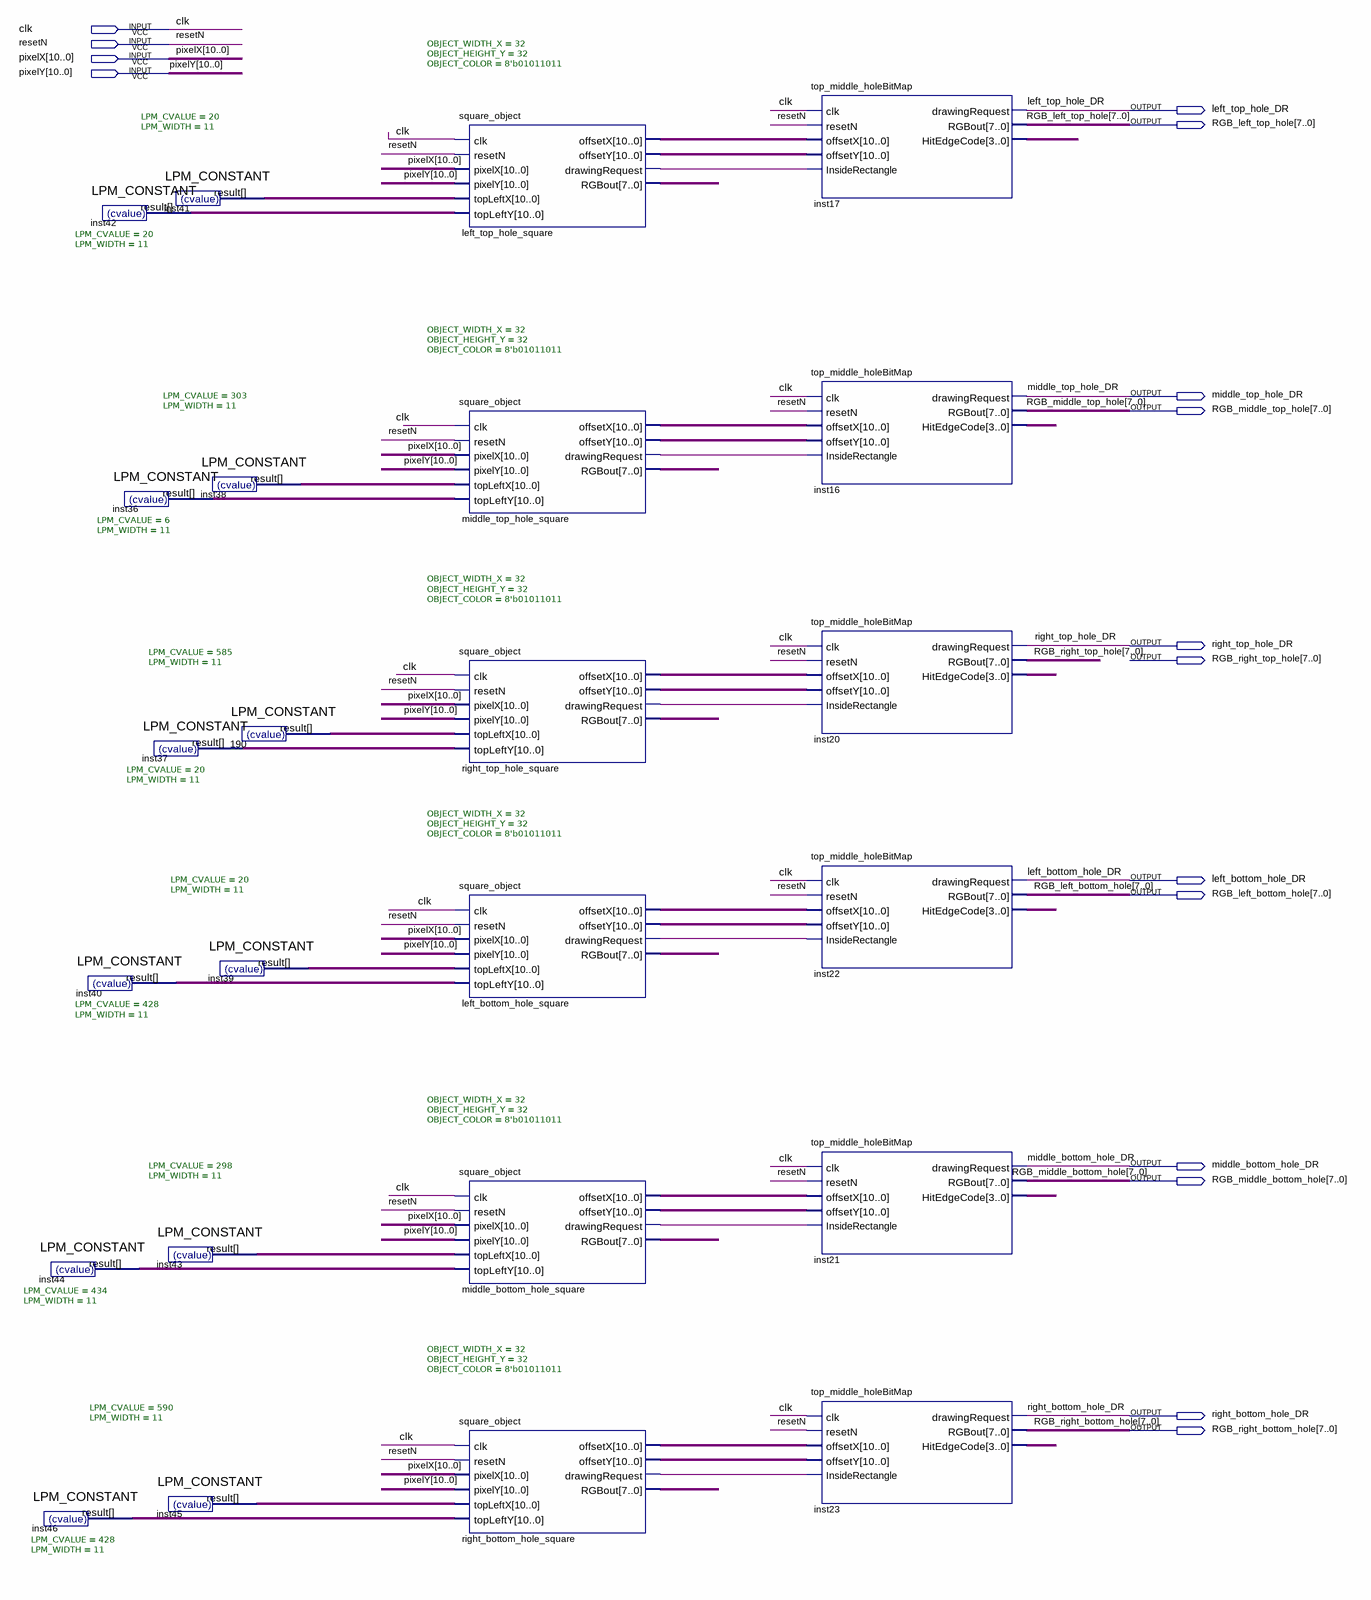
[diagram p0: schematic sheet]
// Quartus schematic Holes_block.bdf as structural Verilog: 24 symbols, 16 pins
module Holes_block (
  input  clk,
  input  resetN,
  input  [10:0] pixelX,
  input  [10:0] pixelY,
  output left_top_hole_DR,
  output [7:0] RGB_left_top_hole,
  output middle_top_hole_DR,
  output [7:0] RGB_middle_top_hole,
  output right_top_hole_DR,
  output [7:0] RGB_right_top_hole,
  output left_bottom_hole_DR,
  output [7:0] RGB_left_bottom_hole,
  output middle_bottom_hole_DR,
  output [7:0] RGB_middle_bottom_hole,
  output right_bottom_hole_DR,
  output [7:0] RGB_right_bottom_hole
);

  wire left_bottom_hole_square_drawingrequest, left_top_hole_square_drawingrequest,
       middle_bottom_hole_square_drawingrequest, middle_top_hole_square_drawingrequest,
       right_bottom_hole_square_drawingrequest, right_top_hole_square_drawingrequest;
  wire [3:0] inst16_hitedgecode, inst17_hitedgecode, inst20_hitedgecode, inst21_hitedgecode,
       inst22_hitedgecode, inst23_hitedgecode;
  wire [7:0] left_bottom_hole_square_rgbout, left_top_hole_square_rgbout, middle_bottom_hole_square_rgbout,
       middle_top_hole_square_rgbout, right_bottom_hole_square_rgbout, right_top_hole_square_rgbout;
  wire [10:0] inst36_result, inst37_result, inst38_result, inst39_result, inst40_result, inst41_result,
       inst42_result, inst43_result, inst44_result, inst45_result, inst46_result,
       left_bottom_hole_square_offsetx, left_bottom_hole_square_offsety, left_top_hole_square_offsetx,
       left_top_hole_square_offsety, middle_bottom_hole_square_offsetx, middle_bottom_hole_square_offsety,
       middle_top_hole_square_offsetx, middle_top_hole_square_offsety, n190_result,
       right_bottom_hole_square_offsetx, right_bottom_hole_square_offsety, right_top_hole_square_offsetx,
       right_top_hole_square_offsety;

  LPM_CONSTANT #(.LPM_CVALUE(428), .LPM_WIDTH(11)) inst40 (.result(inst40_result));
  LPM_CONSTANT #(.LPM_CVALUE(434), .LPM_WIDTH(11)) inst44 (.result(inst44_result));
  LPM_CONSTANT #(.LPM_CVALUE(428), .LPM_WIDTH(11)) inst46 (.result(inst46_result));
  LPM_CONSTANT #(.LPM_CVALUE(20), .LPM_WIDTH(11)) inst42 (.result(inst42_result));
  LPM_CONSTANT #(.LPM_CVALUE(6), .LPM_WIDTH(11)) inst36 (.result(inst36_result));
  LPM_CONSTANT #(.LPM_CVALUE(20), .LPM_WIDTH(11)) inst41 (.result(inst41_result));
  LPM_CONSTANT #(.LPM_CVALUE(20), .LPM_WIDTH(11)) inst37 (.result(inst37_result));
  LPM_CONSTANT #(.LPM_CVALUE(298), .LPM_WIDTH(11)) inst43 (.result(inst43_result));
  LPM_CONSTANT #(.LPM_CVALUE(590), .LPM_WIDTH(11)) inst45 (.result(inst45_result));
  LPM_CONSTANT #(.LPM_CVALUE(303), .LPM_WIDTH(11)) inst38 (.result(inst38_result));
  LPM_CONSTANT #(.LPM_CVALUE(585), .LPM_WIDTH(11)) u_190 (.result(n190_result));
  LPM_CONSTANT #(.LPM_CVALUE(20), .LPM_WIDTH(11)) inst39 (.result(inst39_result));
  square_object #(.OBJECT_WIDTH_X(32), .OBJECT_HEIGHT_Y(32), .OBJECT_COLOR(8'b01011011)) left_top_hole_square (
    .clk(clk), .resetN(resetN), .pixelX(pixelX), .pixelY(pixelY), .topLeftX(inst41_result),
    .topLeftY(inst42_result), .offsetX(left_top_hole_square_offsetx), .offsetY(left_top_hole_square_offsety),
    .drawingRequest(left_top_hole_square_drawingrequest), .RGBout(left_top_hole_square_rgbout));
  square_object #(.OBJECT_WIDTH_X(32), .OBJECT_HEIGHT_Y(32), .OBJECT_COLOR(8'b01011011)) middle_top_hole_square (
    .clk(clk), .resetN(resetN), .pixelX(pixelX), .pixelY(pixelY), .topLeftX(inst38_result),
    .topLeftY(inst36_result), .offsetX(middle_top_hole_square_offsetx),
    .offsetY(middle_top_hole_square_offsety), .drawingRequest(middle_top_hole_square_drawingrequest),
    .RGBout(middle_top_hole_square_rgbout));
  square_object #(.OBJECT_WIDTH_X(32), .OBJECT_HEIGHT_Y(32), .OBJECT_COLOR(8'b01011011)) right_top_hole_square (
    .clk(clk), .resetN(resetN), .pixelX(pixelX), .pixelY(pixelY), .topLeftX(n190_result),
    .topLeftY(inst37_result), .offsetX(right_top_hole_square_offsetx),
    .offsetY(right_top_hole_square_offsety), .drawingRequest(right_top_hole_square_drawingrequest),
    .RGBout(right_top_hole_square_rgbout));
  square_object #(.OBJECT_WIDTH_X(32), .OBJECT_HEIGHT_Y(32), .OBJECT_COLOR(8'b01011011)) left_bottom_hole_square (
    .clk(clk), .resetN(resetN), .pixelX(pixelX), .pixelY(pixelY), .topLeftX(inst39_result),
    .topLeftY(inst40_result), .offsetX(left_bottom_hole_square_offsetx),
    .offsetY(left_bottom_hole_square_offsety), .drawingRequest(left_bottom_hole_square_drawingrequest),
    .RGBout(left_bottom_hole_square_rgbout));
  square_object #(.OBJECT_WIDTH_X(32), .OBJECT_HEIGHT_Y(32), .OBJECT_COLOR(8'b01011011)) middle_bottom_hole_square (
    .clk(clk), .resetN(resetN), .pixelX(pixelX), .pixelY(pixelY), .topLeftX(inst43_result),
    .topLeftY(inst44_result), .offsetX(middle_bottom_hole_square_offsetx),
    .offsetY(middle_bottom_hole_square_offsety), .drawingRequest(middle_bottom_hole_square_drawingrequest),
    .RGBout(middle_bottom_hole_square_rgbout));
  square_object #(.OBJECT_WIDTH_X(32), .OBJECT_HEIGHT_Y(32), .OBJECT_COLOR(8'b01011011)) right_bottom_hole_square (
    .clk(clk), .resetN(resetN), .pixelX(pixelX), .pixelY(pixelY), .topLeftX(inst45_result),
    .topLeftY(inst46_result), .offsetX(right_bottom_hole_square_offsetx),
    .offsetY(right_bottom_hole_square_offsety), .drawingRequest(right_bottom_hole_square_drawingrequest),
    .RGBout(right_bottom_hole_square_rgbout));
  top_middle_holeBitMap inst17 (
    .clk(clk), .resetN(resetN), .offsetX(left_top_hole_square_offsetx),
    .offsetY(left_top_hole_square_offsety), .InsideRectangle(left_top_hole_square_drawingrequest),
    .drawingRequest(left_top_hole_DR), .RGBout(RGB_left_top_hole), .HitEdgeCode(inst17_hitedgecode));
  top_middle_holeBitMap inst16 (
    .clk(clk), .resetN(resetN), .offsetX(middle_top_hole_square_offsetx),
    .offsetY(middle_top_hole_square_offsety), .InsideRectangle(middle_top_hole_square_drawingrequest),
    .drawingRequest(middle_top_hole_DR), .RGBout(RGB_middle_top_hole), .HitEdgeCode(inst16_hitedgecode));
  top_middle_holeBitMap inst20 (
    .clk(clk), .resetN(resetN), .offsetX(right_top_hole_square_offsetx),
    .offsetY(right_top_hole_square_offsety), .InsideRectangle(right_top_hole_square_drawingrequest),
    .drawingRequest(right_top_hole_DR), .RGBout(RGB_right_top_hole), .HitEdgeCode(inst20_hitedgecode));
  top_middle_holeBitMap inst22 (
    .clk(clk), .resetN(resetN), .offsetX(left_bottom_hole_square_offsetx),
    .offsetY(left_bottom_hole_square_offsety), .InsideRectangle(left_bottom_hole_square_drawingrequest),
    .drawingRequest(left_bottom_hole_DR), .RGBout(RGB_left_bottom_hole), .HitEdgeCode(inst22_hitedgecode));
  top_middle_holeBitMap inst21 (
    .clk(clk), .resetN(resetN), .offsetX(middle_bottom_hole_square_offsetx),
    .offsetY(middle_bottom_hole_square_offsety), .InsideRectangle(middle_bottom_hole_square_drawingrequest),
    .drawingRequest(middle_bottom_hole_DR), .RGBout(RGB_middle_bottom_hole), .HitEdgeCode(inst21_hitedgecode));
  top_middle_holeBitMap inst23 (
    .clk(clk), .resetN(resetN), .offsetX(right_bottom_hole_square_offsetx),
    .offsetY(right_bottom_hole_square_offsety), .InsideRectangle(right_bottom_hole_square_drawingrequest),
    .drawingRequest(right_bottom_hole_DR), .RGBout(RGB_right_bottom_hole), .HitEdgeCode(inst23_hitedgecode));
endmodule
